# EAGLE design OR or NOR gate (EAGLE 5.11)
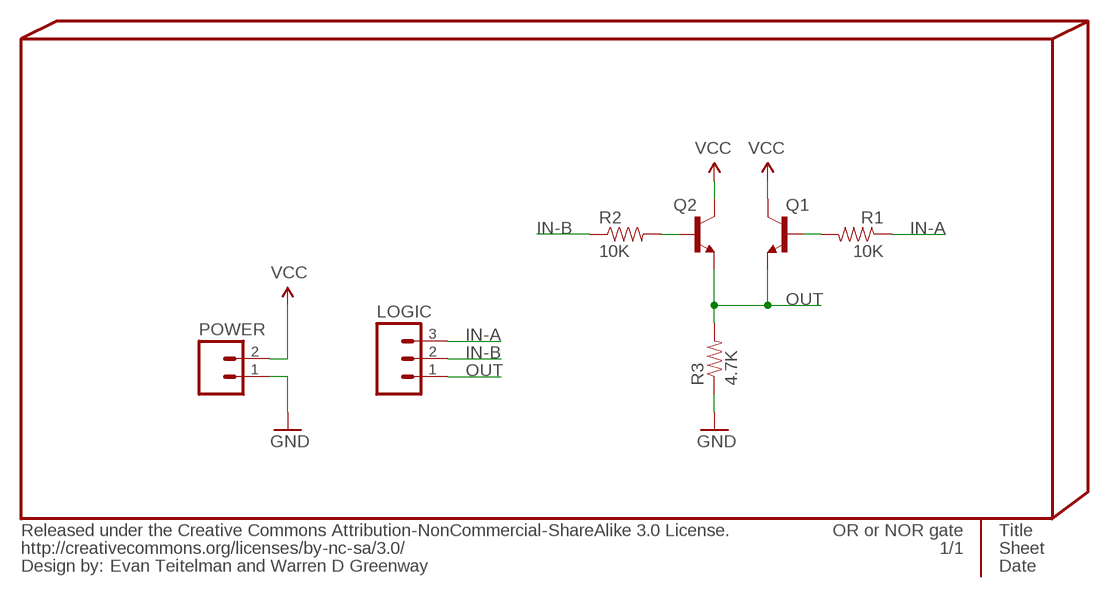
[diagram p0: schematic, sheet 1]

## Parts
INFO4  Evan Teitelman and Warren D Greenway  %CC-NC-SA  [%CC-NC-SA]
LOGIC  M03PTH  [1X03]
POWER  M02PTH  [1X02]
Q1  TRANSISTOR_NPNSOT23  [SOT23]
Q2  TRANSISTOR_NPNSOT23  [SOT23]
R1  10K  RESISTOR0402-RES  [0402-RES]
R2  10K  RESISTOR0402-RES  [0402-RES]
R3  4.7K  RESISTOR0402-RES  [0402-RES]

## Nets
GND: POWER.1 R3.1 ; supply symbol labelled @GND
IN-A: LOGIC.3 R1.1
IN-B: LOGIC.2 R2.1
N$3: Q1.1(B) R1.2
N$4: Q2.1(B) R2.2
OUT: LOGIC.1 Q1.2(E) Q2.2(E) R3.2
VCC: POWER.2 Q1.3(C) Q2.3(C) ; supply symbol labelled @VCC

## Library data of the parts
INFO4 = PygmyBoards:%CC-NC-SA: Released under the Creative Commons Attribution-NonCommercial-ShareAlike 3.0 License. http://creativecommons.org/licenses/by-sa/3.0 Design by: [Designer Name] Change this part's value to change the designer name
LOGIC = SparkFun:M03: Header 3 Standard 3-pin 0.1" header. Use with straight break away headers (SKU : PRT-00116), right angle break away headers (PRT-00553), swiss pins (PRT-00743), machine pins (PRT-00117), and female headers (PRT-00115). Molex polarized connector foot print use with SKU : PRT-08232 with associated crimp pins and housings.
POWER = SparkFun:M02: Header 2 Standard 2-pin 0.1" header. Use with straight break away headers (SKU : PRT-00116), right angle break away headers (PRT-00553), swiss pins (PRT-00743), machine pins (PRT-00117), and female headers (PRT-00115). Molex polarized connector foot print use with SKU : PRT-08233 with associated crimp pins and housings.
Q1 Q2 = SparkFun:TRANSISTOR_NPN: Transistor NPN BJT configuration in SOT23 package. MMBT2222 is the common NPN we use. Double check BCE configuration again layout.
R1-R3 = SparkFun:RESISTOR: Resistor Basic schematic elements and footprints for 0603, 1206, and PTH resistors.

## Board
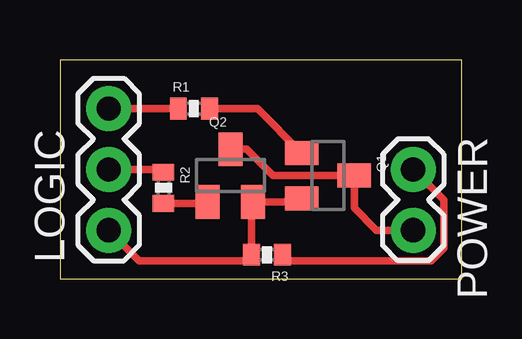
[diagram p1: board, top side]

Size 16.76 x 9.14 mm. Coordinates in mm from the lower left corner, seen from the top.
Outline: 0,0 16.76,0 16.76,9.14 0,9.14 0,0
Copper layers (1*16): Top 0.035mm / dielectric 1.5mm / Bottom 0.035mm
Design rules "PDX (Production)": minimum track width 6mil, minimum drill 13mil, track to track 6mil, track to pad 6mil, pad to pad 4mil, via to via 6mil, smd to smd 4mil, copper to edge 15mil, drill to drill 6mil, minimum pad ring 10mil, minimum via ring 8mil, stop-mask expansion 4mil, vias tented up to drill 25mil, thermal gap 10mil

### Footprints (pad centres in the part's own frame; a part is rotated, then mirrored left to right if it is on the bottom)
1X03 = drill 1.016 pad 1.88 round: 1 0,0; 2 2.54,0; 3 5.08,0
1X02 = drill 1.016 pad 1.88 round: 1 0,0; 2 2.54,0
SOT23 = smd 1 x 1.4: 1 -0.95,-1.1; 2 0.95,-1.1; 3 0,1.1
0402-RES = smd 0.7 x 0.9: 1 -0.65,0; 2 0.65,0

### Placement (x,y rotation side)
INFO4  0,-7.62 0 top  (outside the outline)
LOGIC  2.03,2.03 90 top
POWER  14.73,4.57 270 top
Q1  11.18,4.32 270 top
Q2  7.11,4.32 0 top
R1  5.59,7.11 0 top
R2  4.32,3.81 270 top
R3  8.64,1.02 180 top

### Tracks (layer width: path | path; a pad name or v marks a point on that pad's centre or on a via)
GND
  Top 0.305: POWER.1 16,3.3 16,1.27 15.49,0.76 9.54,0.76 R3.1
IN-A
  Top 0.305: LOGIC.3 R1.1
IN-B
  Top 0.305: R2.1 4.21,4.57 LOGIC.2
N$3
  Top 0.305: Q1.1 8.23,7.11 R1.2
N$4
  Top 0.305: Q2.1 6.1,3.16 R2.2
OUT
  Top 0.305: Q1.2 9.87,3.37 9.72,3.22 Q2.2 7.99,3.14 R3.2 7.73,0.76 3.3,0.76 LOGIC.1
VCC
  Top 0.305: POWER.2 13.21,2.03 12.28,2.96 Q1.3 8.89,4.32 7.79,5.42 Q2.3

### Text on the board
_bsilk: AND | Out | In-B | Gnd | In-A | Vcc